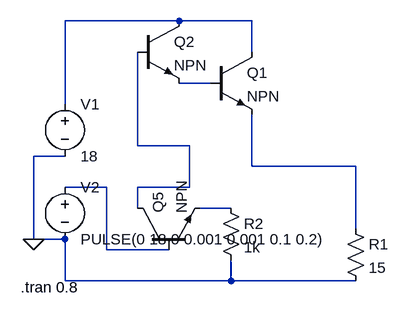
[diagram p0: schematic DarlingtonPair.asc]
DarlingtonPair.asc, the LTspice schematic file:
Version 4
SHEET 1 880 680
WIRE -192 -160 -368 -160
WIRE -80 -160 -192 -160
WIRE -80 -112 -80 -160
WIRE -144 -64 -192 -64
WIRE -368 -32 -368 -160
WIRE -256 32 -256 -112
WIRE -176 32 -256 32
WIRE -368 48 -416 48
WIRE -80 64 -80 -16
WIRE 80 64 -80 64
WIRE -304 96 -368 96
WIRE -176 96 -176 32
WIRE -176 96 -256 96
WIRE -256 128 -256 96
WIRE -112 128 -160 128
WIRE 80 160 80 64
WIRE -416 176 -416 48
WIRE -368 176 -416 176
WIRE -304 192 -304 96
WIRE -208 192 -304 192
WIRE -368 240 -368 176
WIRE -112 240 -112 208
WIRE -112 240 -368 240
WIRE 80 240 -112 240
FLAG -416 176 0
SYMBOL npn -256 -160 R0
SYMATTR InstName Q2
SYMBOL voltage -368 -48 R0
WINDOW 123 0 0 Left 2
WINDOW 39 0 0 Left 2
SYMATTR InstName V1
SYMATTR Value 18
SYMBOL voltage -368 80 R0
WINDOW 123 0 0 Left 2
WINDOW 39 0 0 Left 2
SYMATTR InstName V2
SYMATTR Value PULSE(0 18 0 0.001 0.001 0.1 0.2)
SYMBOL res 64 144 R0
SYMATTR InstName R1
SYMATTR Value 15
SYMBOL npn -256 192 R270
SYMATTR InstName Q5
SYMBOL res -128 112 R0
SYMATTR InstName R2
SYMATTR Value 1k
SYMBOL npn -144 -112 R0
SYMATTR InstName Q1
TEXT -436 250 Left 2 !.tran 0.8

The netlist it stands for:
* DarlingtonPair.asc
Q2 N001 N003 N002 0 NPN
V1 N001 0 18
V2 N005 0 PULSE(0 18 0 0.001 0.001 0.1 0.2)
R1 N004 0 15
Q5 N003 N005 N006 0 NPN
R2 N006 0 1k
Q1 N001 N002 N004 0 NPN
.model NPN NPN
.model PNP PNP
.lib standard.bjt
.tran 0.8
.backanno
.end